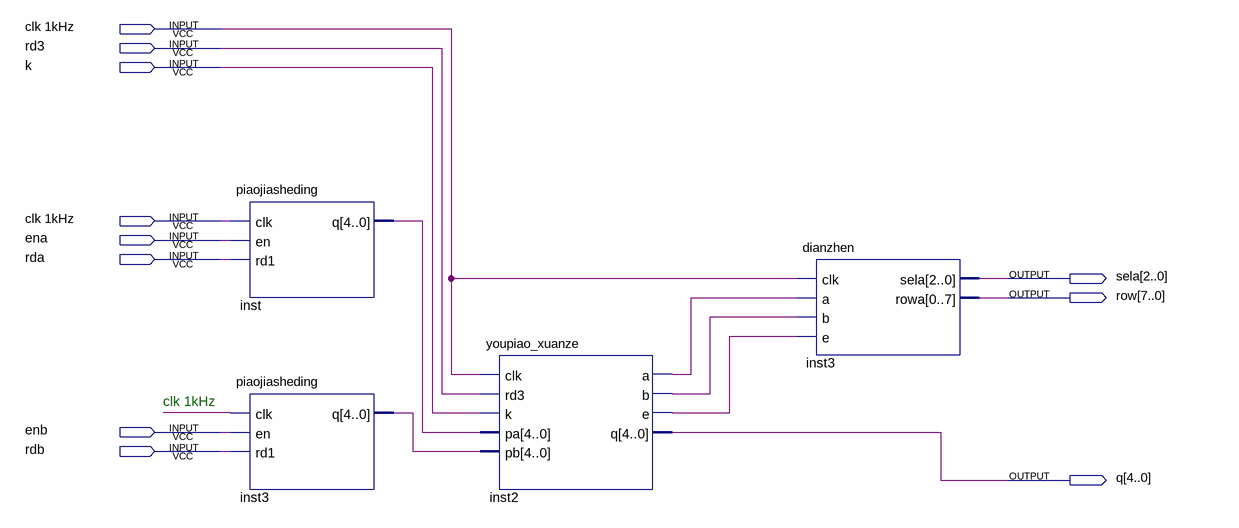
[diagram p0: schematic sheet]
// Quartus schematic xuanze_1.bdf as structural Verilog: 4 symbols, 11 pins
module xuanze_1 (
  input  \clk_1kHz ,
  input  rd3,
  input  k,
  input  ena,
  input  rda,
  input  enb,
  input  rdb,
  output [2:0] sela,
  output [7:0] row,
  output [4:0] q
);

  wire inst2_a, inst2_b, inst2_e, undriven;
  wire [4:0] inst3_q, inst_q;

  piaojiasheding inst (.clk(\clk_1kHz ), .en(ena), .rd1(rda), .q(inst_q));
  piaojiasheding inst3 (.clk(undriven), .en(enb), .rd1(rdb), .q(inst3_q));
  youpiao_xuanze inst2 (
    .clk(\clk_1kHz ), .rd3(rd3), .k(k), .pa(inst_q), .pb(inst3_q), .a(inst2_a), .b(inst2_b), .e(inst2_e),
    .q(q));
  dianzhen inst3_dup2 (.clk(\clk_1kHz ), .a(inst2_a), .b(inst2_b), .e(inst2_e), .sela(sela), .rowa(row));

  // Notes on the sheet:
  //   clk 1kHz
endmodule
